# Altium schematic sheet Sheet1.SchDoc
size A4
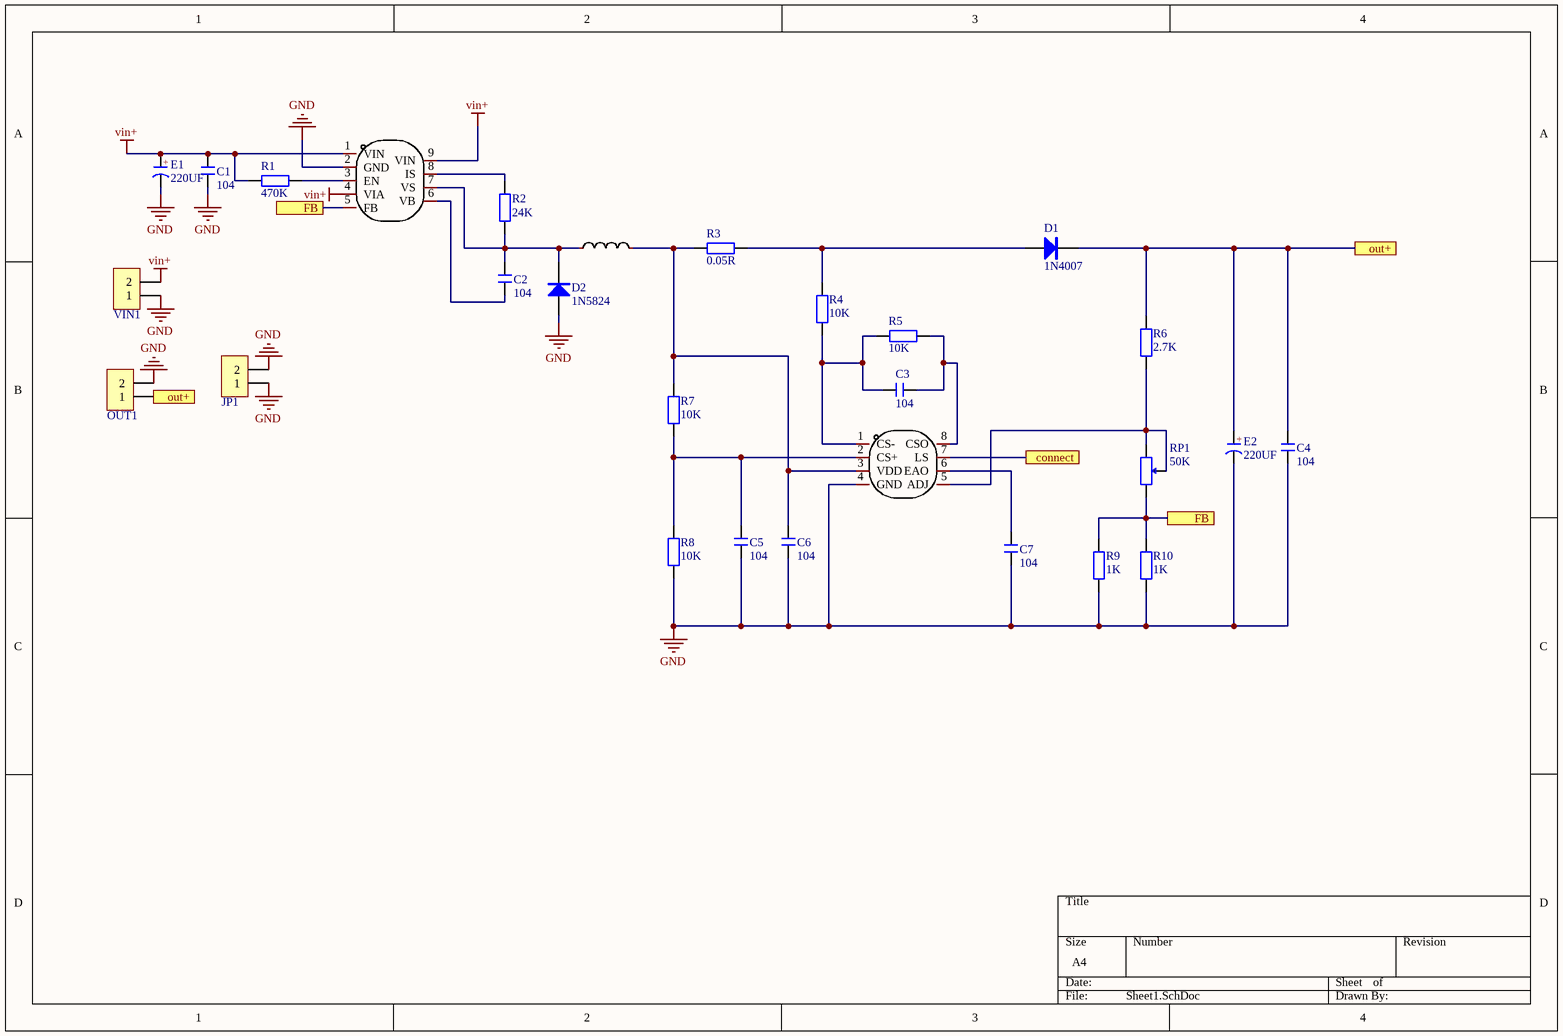
[diagram p0: Sheet1.SchDoc]

## Parts
C1  104  [C 0805]
C2  104  [C 0805]
C3  104  [C 0805]
C4  104  [C 0805]
C5  104  [C 0805]
C6  104  [C 0805]
C7  104  [C 0805]
D1  1N4007  [SMA_L4.4-W2.8-LS5.4-R-RD]
D2  1N5824  [SMA_L4.4-W2.8-LS5.4-R-RD]
E1  220UF  [CAP 3.5*8*11.5 - GD]
E2  220UF  [CAP 3.5*8*11.5 - GD]
JP1  HDR-1X2  [KF350-2P]  (value not drawn)
L1  TMPC1004H-1R0MG-D  [CDRH127]  (value not drawn)
OUT1  HDR-1X2  [KF350-2P]  (value not drawn)
R1  470K  [R 0805]
R2  24K  [R 0805]
R3  0.05R  [R2512]
R4  10K  [R 0805]
R5  10K  [R 0805]
R6  2.7K  [R 0805]
R7  10K  [R 0805]
R8  10K  [R 0805]
R9  1K  [R 0805]
R10  1K  [R 0805]
RP1  50K  [3296W]
U1  EG1192  [ESOP-8_L4.9-W3.9-P1.27-LS6.0-BL-EP]  (value not drawn)
U2  UCC39002D  [SOIC-8_L4.9-W3.9-P1.27-LS6.0-BL]  (value not drawn)
VIN1  HDR-1X2  [KF350-2P]  (value not drawn)

## Ports
connect, FB, out+

## Nets
GND: C1.2 C4.1 C5.2 C6.2 C7.2 D2.1(A) E1.2(K) E2.2(K) JP1.1 JP1.2 OUT1.2 R8.1 R9.1 R10.1 U1.2(GND) U2.4(GND) VIN1.1
vin+: C1.1 E1.1(A) R1.2 U1.1(VIN) U1.4(VIA) U1.9(VIN) VIN1.2
connect: U2.7(LS) ; port connect
FB: R9.2 R10.2 RP1.3 U1.5(FB) ; port FB
out+: C4.2 D1.2(K) E2.1(A) OUT1.1 R6.2 ; port out+
NetC2_1: C2.1 U1.6(VB)
NetC2_2: C2.2 D2.2(K) L1.1 R2.1 U1.7(VS)
NetC3_1: C3.1 R5.1 U2.8(CSO)
NetC3_2: C3.2 R4.1 R5.2 U2.1(CS-)
NetC5_1: C5.1 R7.1 R8.2 U2.2(CS+)
NetC6_1: C6.1 L1.2 R3.1 R7.2 U2.3(VDD)
NetC7_1: C7.1 U2.6(EAO)
NetD1_1: D1.1(A) R3.2 R4.2
NetR1_1: R1.1 U1.3(EN)
NetR2_2: R2.2 U1.8(IS)
NetR6_1: R6.1 RP1.1 RP1.2 U2.5(ADJ)

## Notes on the sheet
- (in symbol C-CAP) +

## Library data of the parts
C1-C7 = C-CC: 直插瓷片电容; 版权归属: 黎明电子style; BOM名称: 直插瓷片电容; 学习资源: https://lmdzstyle.taobao.com/
D1 D2 = 1N4007: 整流二极管; 版权归属: 源创客; BOM名称: 整流二极管; 学习资源: www.ooocke.com
E1 E2 = C-CAP: 直插电解电容; 版权归属: 黎明电子style; BOM名称: 直插电解电容; 学习资源: https://lmdzstyle.taobao.com/
JP1 OUT1 VIN1 = Header 2: 2P接插件; 版权归属: 黎明电子style; BOM名称: 2P接插件; 学习资源: https://lmdzstyle.taobao.com/
L1 = TMPC1004H-1R0MG-D: Manufacturer: TAI-TECH(台庆); Name: 1uH; Add into BOM: yes; Value: 1uH; Tolerance: ±20%; Rated Current: 18A; DC Resistance (DCR): 3.3mΩ; Symbol: TMPC1004H-1R0MG-D; Device: TMPC1004H-1R0MG-D; LCSC Part Name: 1uH ±20% 18A 3.3mΩ; Supplier Part: C245069; Manufacturer Part: TMPC1004H-1R0MG-D; Supplier Footprint: SMD; JLCPCB Part Class: Extended Part; Datasheet: https://atta.szlcsc.com/upload/public/pdf/source/20191023/C357241_61800E9DA33BD8AEE74ACE143FB31C9E.pdf; Supplier: LCSC; Convert to PCB: yes
R1 R2 R4-R10 = R: 贴片电阻; 版权归属: 黎明电子style; BOM名称: 贴片电阻; 学习资源: https://lmdzstyle.taobao.com/
R3 = R-I: 电流检测电阻; 版权归属: 黎明电子style; BOM名称: 电流检测电阻; 学习资源: https://lmdzstyle.taobao.com/
RP1 = RP-ID: 插件单联电位器; BOM名称: 插件电位器; 版权归属: 黎明电子style; 学习资源: https://lmdzstyle.taobao.com/
U1 = EG1192: Manufacturer: EG(屹晶微); Add into BOM: yes; Name: EG1192; Symbol: EG1192; Device: EG1192; LCSC Part Name: EG1192; Supplier Part: C2929084; Manufacturer Part: EG1192; Supplier Footprint: ESOP-8; JLCPCB Part Class: Extended Part; Datasheet: https://atta.szlcsc.com/upload/public/pdf/source/20211210/B01B7477DA9546BB1894AF17BC5F9B4C.pdf; Supplier: LCSC; Convert to PCB: yes
U2 = UCC39002D: Manufacturer: TI(德州仪器); Add into BOM: yes; Name: UCC39002D; Symbol: UCC39002D; Device: UCC39002D; LCSC Part Name: UCC39002D; Supplier Part: C1574949; Manufacturer Part: UCC39002D; Supplier Footprint: SOIC-8; JLCPCB Part Class: Extended Part; Supplier: LCSC; Convert to PCB: yes